# EAGLE design NORB3 (EAGLE 6.4)
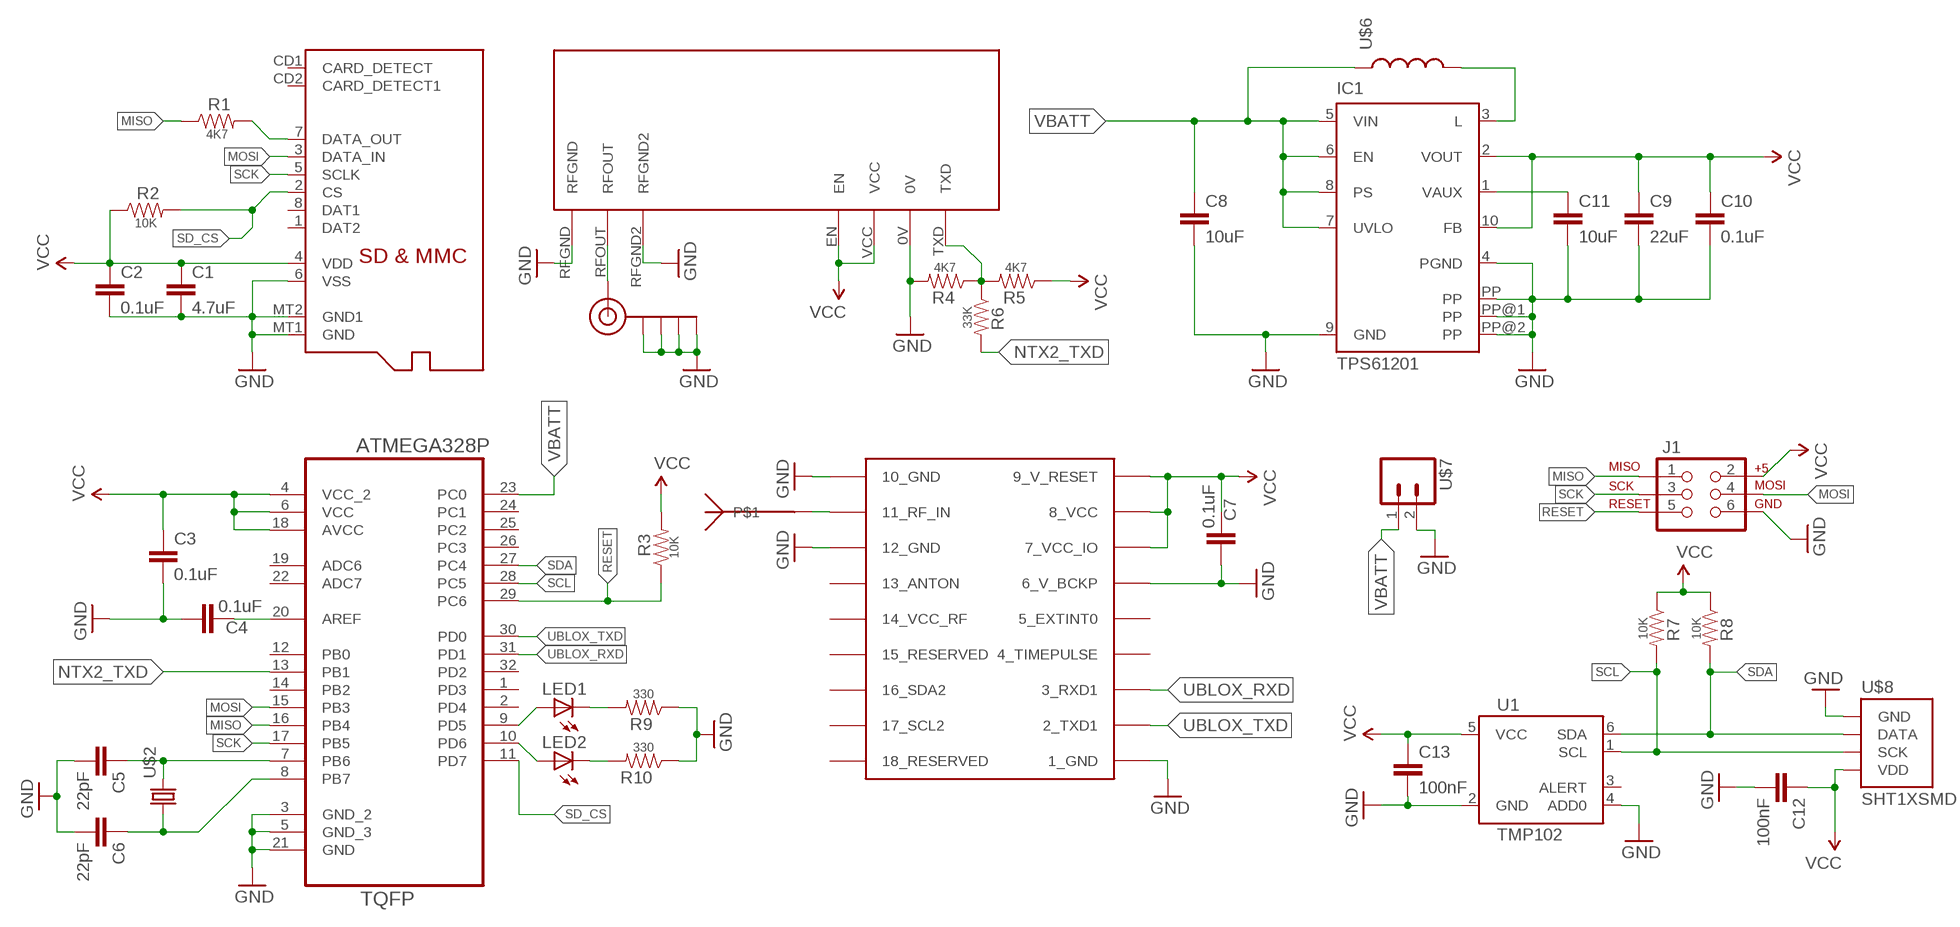
[diagram p0: schematic, sheet 1]

## Parts
C1  4.7uF  CAP0603-CAP  [0603-CAP]
C2  0.1uF  CAP0603-CAP  [0603-CAP]
C3  0.1uF  CAP0603-CAP  [0603-CAP]
C4  0.1uF  CAP0603-CAP  [0603-CAP]
C5  22pF  CAP0603-CAP  [0603-CAP]
C6  22pF  CAP0603-CAP  [0603-CAP]
C7  0.1uF  CAP0603-CAP  [0603-CAP]
C8  10uF  CAP1206  [1206]
C9  22uF  CAP1206  [1206]
C10  0.1uF  CAP0603-CAP  [0603-CAP]
C11  10uF  CAP0603-CAP  [0603-CAP]
C12  100nF  CAP0603-CAP  [0603-CAP]
C13  100nF  CAP0603-CAP  [0603-CAP]
IC1  TPS61201  [S-PDSO-N10]
J1  AVR_SPI_PRG_6PTH  [2X3]
J$1  SMA_EDGE  [SMA-EDGE]
LED1  LEDCHIPLED_0805  [CHIPLED_0805]
LED2  LEDCHIPLED_0805  [CHIPLED_0805]
R1  4K7  RESISTOR0603  [0603-RES]
R2  10K  RESISTOR0603  [0603-RES]
R3  10K  RESISTOR0603  [0603-RES]
R4  4K7  RESISTOR0603  [0603-RES]
R5  4K7  RESISTOR0603  [0603-RES]
R6  33K  RESISTOR0603  [0603-RES]
R7  10K  RESISTOR0603  [0603-RES]
R8  10K  RESISTOR0603  [0603-RES]
R9  330  RESISTOR0603  [0603-RES]
R10  330  RESISTOR0603  [0603-RES]
U1  TMP102  [SOT563]
U2  ATMEGA328P-AU  [QFP80P900X900X120-32N]
U$1  MICROSD  [MICROSD]
U$2  ABRACON_ABM3_CRYSTALABM03_HC49  [ABM03_HC49]
U$3  UBLOX_MAX-6  [UBLOX_MAX-6]
U$4  TAOGLAS.GP.1575.18.2.A.02  [TAOGLAS.GP.1575.18.2.A.02]
U$5  NTX2  [NTX2]
U$6  2.2uH  ELLVGG_INDUCTOR  [ELLVGG_INDUCTOR]
U$7  M02-NOSILK  [M02-NOSILK]
U$8  SHT1XSMD  [SHT1X]

## Nets
GND: C3.2 C4.2 C5.2 C6.2 C7.2 C8.2 C9.2 C10.2 C11.2 C12.2 C13.2 IC1.4(PGND) IC1.9(GND) IC1.PP IC1.PP@1(PP) IC1.PP@2(PP) J1.6 J$1.GND@0(GND) J$1.GND@1(GND) J$1.GND@2(GND) J$1.GND@3(GND) R4.2 R9.1 R10.1 U1.2(GND) U1.4(ADD0) U2.3(GND_2) U2.5(GND_3) U2.21(GND) U$3.1_GND U$3.6_V_BCKP U$3.10_GND U$3.12_GND U$5.0V U$5.RFGND U$5.RFGND2 U$7.2 U$8.1(GND)
MISO: J1.1 R1.1 U2.16(PB4)
MOSI: J1.4 U2.15(PB3) U$1.3(DATA_IN)
N$1: R1.2 U$1.7(DATA_OUT)
N$2: C5.1 U2.7(PB6) U$2.2
N$3: C4.1 U2.20(AREF)
N$4: C6.1 U2.8(PB7) U$2.1
N$5: U$3.11_RF_IN U$4.P$1
N$6: J$1.SIG(SIGNAL) U$5.RFOUT
N$7: IC1.3(L) U$6.P$2
N$8: R4.1 R5.2 R6.1 U$5.TXD
N$9: LED1.A U2.9(PD5)
N$10: C11.1 IC1.1(VAUX)
N$11: LED1.C R9.2
N$12: LED2.A U2.10(PD6)
N$13: LED2.C R10.2
NTX2_TXD: R6.2 U2.13(PB1)
RESET: J1.5 R3.1 U2.29(PC6)
SCK: J1.3 U2.17(PB5) U$1.5(SCLK)
SCL: R7.2 U1.1(SCL) U2.28(PC5) U$8.3(SCK)
SD_CS: R2.2 U2.11(PD7) U$1.2(CS)
SDA: R8.2 U1.6(SDA) U2.27(PC4) U$8.2(DATA)
UBLOX_RXD: U2.31(PD1) U$3.3_RXD1
UBLOX_TXD: U2.30(PD0) U$3.2_TXD1
VBATT: C8.1 IC1.5(VIN) IC1.6(EN) IC1.7(UVLO) IC1.8(PS) U2.23(PC0) U$6.P$1 U$7.1
VCC: C1.1 C2.1 C3.1 C7.1 C9.1 C10.1 C12.1 C13.1 IC1.2(VOUT) IC1.10(FB) J1.2 R2.1 R3.2 R5.1 R7.1 R8.1 U1.5(VCC) U2.4(VCC_2) U2.6(VCC) U2.18(AVCC) U$1.4(VDD) U$3.7_VCC_IO U$3.8_VCC U$3.9_V_RESET U$5.EN U$5.VCC U$8.4(VDD)
VSS: C1.2 C2.2 U$1.6(VSS) U$1.MT1(GND) U$1.MT2(GND1) ; supply symbol labelled GND
Unconnected: U1.3(ALERT) U2.1(PD3) U2.2(PD4) U2.12(PB0) U2.14(PB2) U2.19(ADC6) U2.22(ADC7) U2.24(PC1) U2.25(PC2) U2.26(PC3) U2.32(PD2) U$1.1(DAT2) U$1.8(DAT1) U$1.CD1(CARD_DETECT) U$1.CD2(CARD_DETECT1) U$3.4_TIMEPULSE U$3.5_EXTINT0 U$3.13_ANTON U$3.14_VCC_RF U$3.15_RESERVED U$3.16_SDA2 U$3.17_SCL2 U$3.18_RESERVED

## Library data of the parts
C1-C13 = SparkFun-Capacitors:CAP: Capacitor Standard 0603 ceramic capacitor, and 0.1" leaded capacitor.
IC1 = texas:TPS6120*: LOW INPUT VOLTAGE SYNCHRONOUS BOOST CONVERTER WITH 1.3-A SWITCHES Source: http://focus.ti.com/lit/ds/symlink/tps61200.pdf; MPN: TPS61201DRCT; OC_FARNELL: unknown; OC_NEWARK: 37M0068
J1 = SparkFun-Connectors:AVR_SPI_PRG_6: AVR ISP 6 Pin This is the reduced ISP connector for AVR programming. Common on Arduino. This footprint will take up less PCB space and can be used with a 10-pin to 6-pin adapter such as SKU: BOB-08508
J$1 = SparkFun-Connectors:SMA_EDGE: SMA Antenna Connector End launch SMA connector. The paste layer has been removed so that the connector can be hand soldered onto the board after reflow.
LED1 LED2 = adafruit:LED: LED OSRAM: - CHIPLED LG R971, LG N971, LY N971, LG Q971, LY Q971, LO R971, LY R971 LH N974, LH R974 LS Q976, LO Q976, LY Q976 LO Q996 - Hyper CHIPLED LW Q18S LB Q993, LB Q99A, LB R99A - SideLED LS A670, LO A670, LY A670, LG A670, LP A670 LB A673, LV A673, LT A673, LW A673 LH A674 LY A675 LS A676, LA A676, LO A676, LY A676, LW A676 LS A679, LY A679, LG A679 - Hyper Micro SIDELEDÂ® LS Y876, LA Y876, LO Y876, LY Y876 LT Y87S - SmartLED LW L88C, LW L88S LB L89C, LB L89S, LG L890 LS L89K, LO L89K, LY L89K LS L896, LA L896, LO L896, LY L896 - TOPLED LS T670, LO T670, LY T670, LG T670, LP T670 LSG T670, LSP T670, LSY T670, LOP T670, LYG T670 LG T671, LOG T671, LSG T671 LB T673, LV T673, LT T673, LW T673 LH T674 LS T676, LA T676, LO T676, LY T676, LB T676, LH T676, LSB T676, LW T676 LB T67C, LV T67C, LT T67C, LS T67K, LO T67K, LY T67K, LW E67C LS E67B, LA E67B, LO E67B, LY E67B, LB E67C, LV E67C, LT E67C LW T67C LS T679, LY T679, LG T679 LS T770, LO T770, LY T770, LG T770, LP T770 LB T773, LV T773, LT T773, LW T773 LH T774 LS E675, LA E675, LY E675, LS T675 LS T776, LA T776, LO T776, LY T776, LB T776 LHGB T686 LT T68C, LB T68C - Hyper Mini TOPLEDÂ® LB M676 - Mini TOPLED SantanaÂ® LG M470 LS M47K, LO M47K, LY M47K Source: http://www.osram.convergy.de/
R1-R10 = SparkFun-Resistors:RESISTOR: Resistor Basic schematic elements and footprints for 0603, 1206, and PTH resistors.
U1 = SparkFun-Sensors:TMP102: I2C degC temp sensor
U2 = Ava:ATMEGA328P-AU; DESCRIPTION: 8-bit Microcontroller with In-System Programmable Flash; MPN: ATMEGA328P-AU; OC_FARNELL: 1715486; OC_NEWARK: 14R4631; PACKAGE: TQFP-32; SUPPLIER: Atmel
U$1 = adafruit:MICROSD: Micro-SD / Transflash card holder with SPI pinout For the 3M # 2908-05WB-MG and/or 4UCON #19656 push-push type
U$2 = Ava:ABRACON_ABM3_CRYSTAL
U$3 = Ava:UBLOX_MAX-6: UBLOX MAX-6
U$4 = Ava:TAOGLAS.GP.1575.18.2.A.02
U$5 = Ava:NTX2: Radiometrix NTX2 Transmitter Module Author Anthony Stirk / http://ava.upuaut.net
U$6 = Ava:ELLVGG_INDUCTOR
U$7 = Ava:M02-NOSILK
U$8 = SparkFun-Sensors:SHT1X: SHT1x Humdity Sensor Sensirion humdity sensor. Schematic element and footprint proven. Spark Fun Electronics SKU : COM-08227

## Board
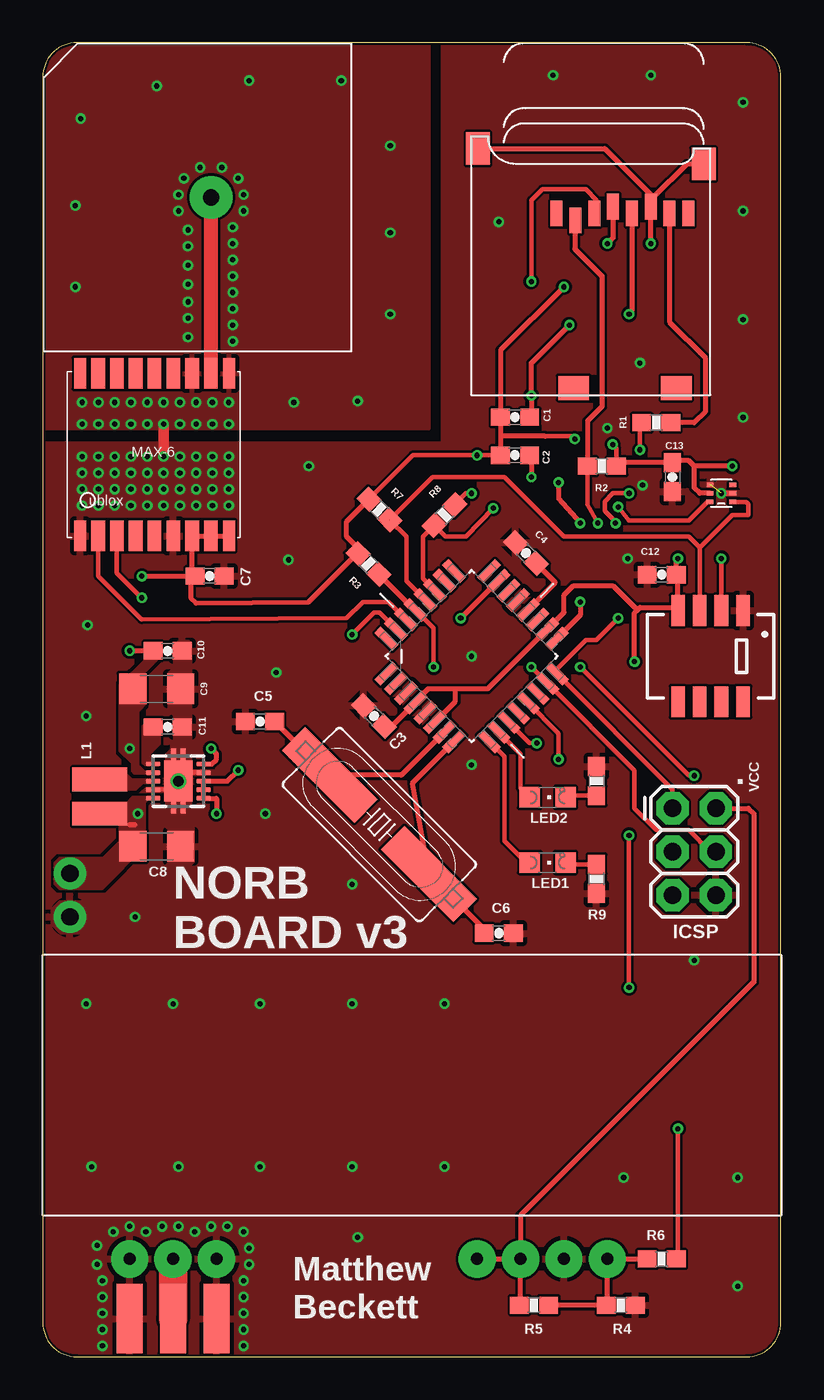
[diagram p1: board, top side]
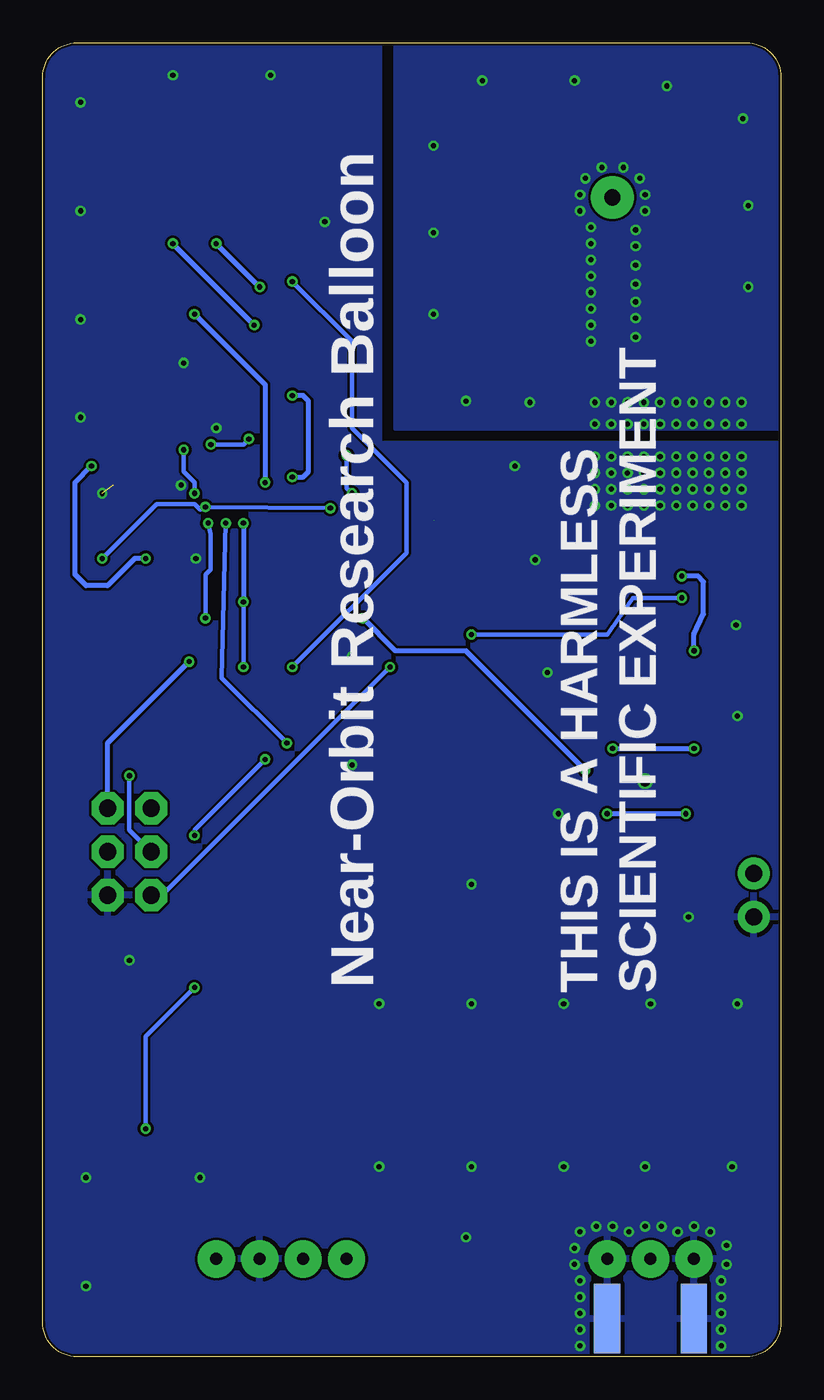
[diagram p2: board, bottom side, seen from below]

Size 43.17 x 76.83 mm. Coordinates in mm from the lower left corner, seen from the top.
Outline: 0,74.83 0,2 arc90 2,0 41.17,0 arc90 43.17,2 43.17,74.83 arc90 41.17,76.83 2,76.83 arc90 0,74.83
Copper layers (1*16): Top 0.035mm / dielectric 1.5mm / Bottom 0.035mm
Design rules "Hackvana_Upu": minimum track width 6mil, minimum drill 0.3mm, track to track 6mil, track to pad 6mil, pad to pad 6mil, via to via 6mil, smd to smd 0mil, copper to edge 6mil, drill to drill 6mil, minimum pad ring 10mil, minimum via ring 6mil, stop-mask expansion 2mil, vias tented up to drill 100mil, thermal gap 10mil

### Footprints (pad centres in the part's own frame; a part is rotated, then mirrored left to right if it is on the bottom)
0603-CAP = smd 1.1 x 1: 1 -0.85,0; 2 0.85,0
1206 = smd 1.6 x 1.8: 1 -1.4,0; 2 1.4,0
S-PDSO-N10 = smd 0.28 x 0.85: 1 -1,-1.475; 2 -0.5,-1.475; 3 0,-1.475; 4 0.5,-1.475; 5 1,-1.475; 6 1,1.475; 7 0.5,1.475; 8 0,1.475; 9 -0.5,1.475; 10 -1,1.475 | smd 2.4 x 1.65: PP 0,0 | smd 3.8 x 0.28: PP@1 0,0.275; PP@2 0,-0.275
2X3 = drill 1.016 pad 1.88 octagon: 1 0,0; 2 0,2.54; 3 2.54,0; 4 2.54,2.54; 5 5.08,0; 6 5.08,2.54
SMA-EDGE = smd 1.524 x 4.064: GND@0 0,0; GND@1 5.08,0; SIG 2.54,0 | smd 1.524 x 4.064 bottom: GND@2 0,0; GND@3 5.08,0
CHIPLED_0805 = smd 1.2 x 1.2: A 0,-1.05; C 0,1.05
0603-RES = smd 1.1 x 1: 1 -0.85,0; 2 0.85,0
SOT563 = smd 0.25 x 0.4: 1 -0.5,-0.66; 2 0,-0.66; 3 0.5,-0.66; 4 0.5,0.66; 5 0,0.66; 6 -0.5,0.67
QFP80P900X900X120-32N = smd 1.473 x 0.508: 1 -4.242,2.794; 2 -4.242,2.007; 3 -4.242,1.194; 4 -4.242,0.406; 5 -4.242,-0.406; 6 -4.242,-1.194; 7 -4.242,-2.007; 8 -4.242,-2.794; 17 4.242,-2.794; 18 4.242,-2.007; 19 4.242,-1.194; 20 4.242,-0.406; 21 4.242,0.406; 22 4.242,1.194; 23 4.242,2.007; 24 4.242,2.794 | smd 0.508 x 1.473: 9 -2.794,-4.242; 10 -2.007,-4.242; 11 -1.194,-4.242; 12 -0.406,-4.242; 13 0.406,-4.242; 14 1.194,-4.242; 15 2.007,-4.242; 16 2.794,-4.242; 25 2.794,4.242; 26 2.007,4.242; 27 1.194,4.242; 28 0.406,4.242; 29 -0.406,4.242; 30 -1.194,4.242; 31 -2.007,4.242; 32 -2.794,4.242
MICROSD = smd 0.7 x 1.5: 1 9,-10.64; 2 7.9,-10.24; 3 6.8,-10.64; 4 5.7,-11.04; 5 4.6,-10.64; 6 3.5,-11.04; 7 2.4,-10.64; 8 1.3,-10.64 | smd 1.8 x 1.4: CD1 2,-0.44; CD2 8,-0.44 | smd 1.4 x 1.9: MT1 0.4,-13.54; MT2 13.6,-14.44
ABM03_HC49 = smd 6 x 1.93: 1 -4.1,0; 2 4.1,0
UBLOX_MAX-6 = smd 1.8 x 0.7: 1_GND 4.95,-4.4; 9_V_RESET 4.95,4.3; 10_GND -4.55,4.3; 18_RESERVED -4.55,-4.4 | smd 1.8 x 0.8: 2_TXD1 4.95,-3.35; 3_RXD1 4.95,-2.25; 4_TIMEPULSE 4.95,-1.15; 5_EXTINT0 4.95,-0.05; 6_V_BCKP 4.95,1.05; 7_VCC_IO 4.95,2.15; 8_VCC 4.95,3.25; 11_RF_IN -4.55,3.25; 12_GND -4.55,2.15; 13_ANTON -4.55,1.05; 14_VCC_RF -4.55,-0.05; 15_RESERVED -4.55,-1.15; 16_SDA2 -4.55,-2.25; 17_SCL2 -4.55,-3.35
TAOGLAS.GP.1575.18.2.A.02 = drill 0.95 pad 2.5: P$1 0,-0.8
NTX2 = drill 0.7 pad 2.184: 0V -2.54,-10.16; EN -7.62,-10.16; RFGND -22.86,-10.16; RFGND2 -27.94,-10.16; RFOUT -25.4,-10.16; TXD 0,-10.16; VCC -5.08,-10.16
ELLVGG_INDUCTOR = smd 1.4 x 3.2: P$1 -0.953,0; P$2 1.048,0
M02-NOSILK = drill 1.016 pad 1.88: 1 0,0; 2 2.54,0
SHT1X = smd 1.8 x 0.8: 1 -2.667,1.905; 2 -2.667,0.635; 3 -2.667,-0.635; 4 -2.667,-1.905; 5 2.667,-1.905; 6 2.667,-0.635; 7 2.667,0.635; 8 2.667,1.905

### Placement (x,y rotation side)
C1  27.62,54.93 0 top
C2  27.62,52.7 0 top
C3  19.37,37.47 135 top
C4  28.26,46.99 135 top
C5  12.7,37.15 180 top
C6  26.67,24.77 0 top
C7  9.76,45.64 0 top
C8  6.67,29.84 0 top
C9  6.67,39.05 0 top
C10  7.3,41.27 0 top
C11  7.3,36.83 0 top
C12  36.2,45.72 180 top
C13  36.83,51.44 270 top
IC1  7.94,33.66 270 top
J1  36.83,32.07 270 top
J$1  5.08,2.22 0 top
LED1  29.53,28.89 270 top
LED2  29.53,32.7 270 top
R1  35.88,54.61 0 top
R2  32.7,52.07 180 top
R3  19.05,46.35 135 top
R4  33.81,3.02 0 top
R5  28.73,3.02 0 top
R6  36.2,5.71 0 top
R7  19.68,49.53 315 top
R8  23.5,49.21 225 top
R9  32.39,27.94 90 top
R10  32.39,33.66 270 top
U1  39.69,50.48 90 top
U2  25.08,40.96 45 top
U$1  39.05,56.2 180 top
U$2  19.68,31.11 135 top
U$3  6.59,52.94 270 top
U$4  9.05,67.79 90 top
U$5  33.02,15.88 0 top
U$6  3.33,32.7 90 top
U$7  1.59,28.26 270 top
U$8  39.05,40.96 270 top

### Tracks (layer width: path | path; a pad name or v marks a point on that pad's centre or on a via)
GND  (via drill 0.3, 0.6)  (1 unrouted)
  Top 0.254: IC1.4 7.16,33.16 IC1.PP@2
  Top 0.305: v39.69,50.48 U1.2 | IC1.9 8.71,34.16 IC1.PP@1
  Top 0.61: v7.06,52.63 v7.06,54.53
  other vias: 3.49,1.59 3.49,2.54 3.49,3.49 3.49,4.45 3.18,5.4 3.18,6.51 4.13,7.3 5.08,7.62 6.03,7.3 6.98,7.62 7.94,7.62 8.89,7.3 9.84,7.62 10.8,7.62 11.75,7.3 12.07,6.35 12.07,5.4 11.75,4.45 11.75,3.49 11.75,1.59 11.75,2.54 2.3,49.77 3.25,49.77 4.21,49.77 5.16,49.77 6.11,49.77 7.06,49.77 8.02,49.77 8.97,49.77 9.92,49.77 10.87,49.77 2.3,50.72 3.25,50.72 4.21,50.72 5.16,50.72 6.11,50.72 7.06,50.72 8.02,50.72 8.97,50.72 9.92,50.72 10.87,50.72 10.87,51.67 9.92,51.67 8.97,51.67 8.02,51.67 7.06,51.67 6.11,51.67 5.16,51.67 4.21,51.67 3.25,51.67 2.3,51.67 2.3,52.63 3.25,52.63 4.21,52.63 5.16,52.63 6.11,52.63 8.02,52.63 8.97,52.63 9.92,52.63 10.87,52.63 2.3,54.53 2.3,55.8 3.25,54.53 3.25,55.8 4.21,55.8 4.21,54.53 5.16,54.53 5.16,55.8 6.11,55.8 6.11,54.53 7.06,55.8 8.02,55.8 8.02,54.53 8.97,54.53 8.97,55.8 9.92,55.8 9.92,54.53 10.87,54.53 10.87,55.8 11.11,59.37 11.11,60.33 11.11,61.28 11.11,62.23 11.11,63.18 11.11,64.14 11.11,65.09 11.11,66.04 11.75,66.99 11.75,67.94 11.43,68.9 10.48,69.53 9.21,69.53 8.25,68.9 7.94,67.94 7.94,66.99 8.49,65.88 8.49,59.61 8.49,60.72 8.49,61.67 8.49,62.71 8.49,63.82 8.49,64.93 34.21,46.67 35.08,50.96 7.94,33.66 2.86,11.11 2.54,20.64 7.62,20.64 12.7,20.64 18.1,20.64 7.94,11.11 12.7,11.11 18.1,11.11 23.5,20.64 23.5,11.11 33.97,10.48 40.64,10.48 38.1,23.18 13.02,31.75 25.08,34.61 13.65,40.01 2.54,37.47 2.62,42.78 5.4,25.72 25.08,40.96 33.02,54.29 34.92,58.1 14.37,46.59 15.56,52.07 40.96,54.93 40.96,60.64 40.96,66.99 40.96,73.34 35.56,74.93 29.85,74.93 26.67,66.36 14.68,55.8 18.41,55.88 20.32,60.96 20.32,65.72 20.32,70.8 17.46,74.61 12.07,74.61 6.67,74.3 2.22,72.39 1.91,67.31 1.91,62.55 18.1,27.62 18.41,6.99 40.64,4.13 3.49,0.64 11.75,0.64
  pour Top (rank 2): 41.18,0 2,0 arc-90 0,2 0,53.34 19.68,53.34 23.5,53.34 23.5,76.52 23.5,76.83 41.18,76.83 arc-90 43.18,74.83 43.18,2 arc-90
  pour Bottom (rank 2): 41.18,0 2,0 arc-90 0,2 0,53.34 19.68,53.34 23.5,53.34 23.5,76.52 23.5,76.83 41.18,76.83 arc-90 43.18,74.83 43.18,2 arc-90
  pour Top: 0,54.29 0,74.83 arc-90 2,76.83 22.54,76.83 22.54,54.29
  pour Bottom: 0,54.29 0,74.83 arc-90 2,76.83 22.54,76.83 22.54,54.29
  pour Top (no thermals): 1.59,26.67 0.95,26.67 0.63,26.35 0.48,26.19 0.48,25.24 0.63,25.08 0.95,24.77 1.03,24.69 4.68,24.69 8.89,28.89 8.89,32.15 8.81,32.23 8.73,32.31 8.73,41.75 8.57,41.91 7.94,41.91 7.62,41.59 7.62,40.32 7.3,40.01 7.3,37.78 7.62,37.47 7.62,35.72 7.14,35.24 7.14,30.96 7.3,30.8 7.3,28.89 5.71,27.3 5.08,26.67
MISO  (via drill 0.3)
  Top 0.254: J1.1 36.83,33.16 U2.16 30.06,40.22 31.75,41.91 32.39,41.91 v33.65,43.18 | v33.5,48.74 33.65,48.66 32.86,49.45 32.86,50.01 33.34,50.48 v34.29,50.48 | v34.93,53.02 34.93,54.51 R1.1
  Bottom 0.254: v33.65,43.18 33.65,45.72 33.34,46.04 33.34,48.1 v33.5,48.74 | v34.29,50.48 34.29,51.12 34.93,51.75 v34.93,53.02
MOSI  (via drill 0.3)
  Top 0.254: J1.4 39.05,29.53 37.78,30.8 35.88,30.8 34.61,32.07 34.61,34.29 34.59,34.29 U2.15 29.5,39.4 v28.57,40.32 | v28.57,62.87 28.57,67.63 29.21,68.26 31.75,68.26 32.39,67.63 32.39,66.97 U$1.3
  Bottom 0.254: v28.57,40.32 21.91,46.99 21.91,51.12 25.08,54.29 25.08,59.37 v28.57,62.87
N$1
  Top 0.305: U$1.7 36.65,60.5 38.74,58.42 38.74,55.24 38.1,54.61 R1.2
N$2
  Top 0.305: U2.7 20.98,34.01 U$2.2 16.68,34.01 C5.1
N$3
  Top 0.305: U2.20 29.97,45.27 C4.1
N$4
  Top 0.305: C6.1 25.82,24.98 U$2.1 21.63,33.55 U2.8
N$5
  Top 0.813: U$3.11_RF_IN 9.84,67.78 U$4.P$1
N$6
  Top 1.676: U$5.RFOUT J$1.SIG
N$7
  pour Top (no thermals): 6.11,33.5 5.87,33.5 5.48,33.1 4.45,33.1 4.13,33.42 4.13,33.97 4.45,34.29 4.76,34.29 5.24,33.81 6.11,33.81 6.35,33.81 6.35,33.5
N$8
  Top 0.305: R6.1 U$5.TXD 33.02,3.02 R4.1 R5.2
N$9
  Top 0.254: U2.9 26.99,35.1 26.99,30.16 28.26,28.89 LED1.A
N$10
  pour Top (no thermals): 6.11,34.53 5.95,34.53 5.79,34.69 5.79,36.91 6.19,37.31 6.75,37.31 6.91,37.15 6.91,35.8 6.35,35.24 6.35,34.53
N$11
  Top 0.254: LED1.C 30.68,28.79 R9.2
N$12
  Top 0.254: LED2.A 27.94,33.24 27.94,35.24 26.66,36.52 U2.10
N$13
  Top 0.254: LED2.C 30.68,32.8 R10.2
NTX2_TXD  (via drill 0.3)
  Top 0.254: U2.13 30.16,36.45 v30.16,34.92 | v34.29,30.48 v34.29,21.59 | v37.15,13.34 37.15,5.71 R6.2
  Bottom 0.254: v30.16,34.92 34.29,30.8 v34.29,30.48 | v34.29,21.59 37.15,18.73 v37.15,13.34
RESET  (via drill 0.3)
  Top 0.254: v22.86,40.32 22.86,42.6 U2.29
  Top 0.305: U2.29 21.74,43.67 R3.1
  Bottom 0.254: J1.5 36.2,26.99 v22.86,40.32
SCK  (via drill 0.3)
  Top 0.254: v38.1,33.97 37.78,33.97 v31.43,40.32
  Top 0.305: U$1.5 34.45,61.12 v34.29,60.96 | v30.16,51.12 30.16,50.16 v31.43,48.74 | v31.43,44.13 31.43,43.36 U2.17
  Bottom 0.254: J1.3 38.1,30.8 v38.1,33.97 | v31.43,40.32 v31.43,44.13
  Bottom 0.305: v34.29,60.96 30.16,56.83 v30.16,51.12 | v31.43,48.74 v31.43,44.13
SCL  (1 unrouted)
  Top 0.254: U2.28 21.27,45.34 21.27,47.94 R7.2 22.79,51.44 26.99,51.44 30.48,47.94 37.78,47.94 38.42,47.31 | U$8.3 38.42,47.31 | 38.42,47.31 40.32,49.21 41.28,49.21 41.28,49.85 41.14,49.98 U1.1
SD_CS  (via drill 0.3)
  Top 0.254: v32.46,48.74 31.85,49.82 R2.2 | v28.89,35.88 28.47,35.88 U2.11
  Top 0.305: U$1.2 31.11,66.4 31.11,64.77 32.7,63.18 32.7,55.56 31.85,54.71 R2.2
  Bottom 0.254: v32.46,48.74 32.7,39.69 v28.89,35.88
SDA  (via drill 0.3)
  Top 0.254: U2.27 22.23,45.5 22.23,47.94 R8.2 23.56,47.94 24.76,47.94 v26.35,49.61 | v33.65,49.69 34.29,48.9 37.78,48.9 38.87,49.98 U1.6 | U$8.2 v39.69,46.67
  Bottom 0.254: v26.35,49.61 v33.65,49.69 33.97,49.53 34.29,49.85 36.51,49.85 v39.69,46.67
UBLOX_RXD  (via drill 0.3)
  Top 0.254: U2.31 19.7,43.5 19.37,43.5 v18.1,42.23 | v5.79,44.37 4.34,45.83 U$3.3_RXD1
  Bottom 0.254: v18.1,42.23 10.16,42.23 8.65,44.37 v5.79,44.37
UBLOX_TXD
  Top 0.254: U$3.2_TXD1 3.24,45.66 5.79,43.1 17.78,43.18 18.73,44.13 20.22,44.13 U2.30
VBATT  (via drill 0.3)
  Top 0.305: v11.43,34.29 10.8,33.66 IC1.8 IC1.7 IC1.6 10.16,32.66 v10.16,31.75 | v24.45,43.18 24.47,43.18 U2.23 | 5.08,31.11 5.4,31.11
  Bottom 0.305: v11.43,34.29 18.41,41.27 22.54,41.27 v24.45,43.18 | v10.16,31.75 v5.56,31.75
  pour Top (no thermals): 6.03,32.78 5.24,32.78 4.84,32.38 4.45,31.99 4.45,30.16 3.49,29.21 0.95,29.21 0.63,28.89 0.63,27.62 0.95,27.3 2.22,27.3 3.49,27.3 6.03,29.84 6.03,30.8 6.03,32.38 6.19,32.54 6.43,32.54 6.43,32.78
VCC  (via drill 0.3)
  Top 0.254: R8.1 24.76,50.48 v25.08,50.48 | C2.1 v25.4,52.7 21.66,52.7 R7.1 | C7.1 8.65,45.38 | 8.65,44.37 8.97,44.05 | 18.38,46.96 R3.2 | R2.1 33.55,53.12 v33.34,53.34 | v31.11,53.66 30.96,53.82 29.37,53.82
  Top 0.305: R5.1 27.94,3.02 U$5.VCC | C3.1 20.41,36.86 U2.4 21.8,38.31 22.54,39.05 24.13,39.05 | U$3.9_V_RESET U$3.8_VCC U$3.7_VCC_IO 8.74,45.82 C7.1 v5.79,45.64 | R3.2 18.45,47.27 17.78,47.94 17.78,48.83 R7.1 | 8.65,45.38 8.65,44.37 | 8.97,44.05 15.56,44.13 18.38,46.96 | C10.1 v5.08,41.27 | U$1.4 33.35,65.42 v33.02,65.09 | v30.48,62.55 26.77,58.84 C1.1 26.77,53.82 | R2.1 33.77,52.28 C13.1 36.93,52.39 37.78,52.39 38.1,52.07 | 26.77,53.82 C2.1 | 29.37,53.82 26.77,53.82 | U$8.4 37.15,44.13 | 37.15,44.13 37.15,45.62 C12.1 37.04,46.57 v37.15,46.67 | U1.5 38.42,50.48 38.1,50.8 38.1,52.07 | v40.32,52.07 38.1,52.07 | v34.61,40.64 34.61,43.5 34.77,43.66 | 34.77,43.66 34.93,43.81 36.83,43.81 37.15,44.13 | J1.2 41.28,32.07 41.59,31.75 41.59,21.91 27.94,8.26 U$5.VCC | 34.77,43.66 33.34,45.09 31.04,45.09 30.48,44.53 30.48,43.52 U2.18 26.02,39.05 24.13,39.05 | U2.6 24.13,38.32 24.13,39.05 | IC1.10 9.89,34.66 10.16,34.92 10.16,35.24 v9.84,35.56 | U$5.EN U$5.VCC
  Bottom 0.254: v25.08,50.48 25.4,50.8 v25.4,52.7 | v33.34,53.34 31.43,53.34 v31.11,53.66
  Bottom 0.305: v5.08,41.27 5.08,42.23 4.52,43.42 4.52,45.32 4.84,45.64 v5.79,45.64 | v33.02,65.09 v30.48,62.55 | v37.15,46.67 37.78,46.67 39.37,45.09 40.64,45.09 41.28,45.72 41.28,51.12 v40.32,52.07 | J1.2 39.37,35.88 v34.61,40.64 | v9.84,35.56 v5.08,35.56
  pour Top (no thermals): 6.03,34.05 5.32,34.05 5.16,34.21 5.16,34.37 5.16,34.69 4.45,35.4 4.45,39.05 4.45,39.29 5.95,40.8 5.95,41.59 6.11,41.75 6.83,41.75 6.98,41.59 6.98,40.96 6.03,40.01 6.03,38.1 5.71,37.78 5.64,37.7 5.64,34.61 5.95,34.29 6.35,34.29 6.35,34.05
VSS  (via drill 0.3)
  Top 0.305: U$1.MT1 37.67,69.74 35.72,67.79 | 35.72,67.79 35.56,67.63 U$1.6 v35.56,65.09 | U$1.MT2 32.87,70.64 35.72,67.79 | C2.2 28.57,52.7 v28.57,51.44 | C1.2 28.57,55.03 v28.57,56.2 28.57,58.1 v30.8,60.33
  Bottom 0.305: v28.57,51.44 27.94,51.44 27.62,51.75 27.62,55.88 27.94,56.2 v28.57,56.2 | v30.8,60.33 v35.56,65.09
(copper drawn outside any net)
  shapes: Top circle x1

### Text on the board
tPlace: NORB / BOARD v3 | Matthew / Beckett
bPlace: Near-Orbit Research Balloon | THIS IS A HARMLESS / SCIENTIFIC EXPERIMENT
tNames: L1 | . | VCC | ICSP